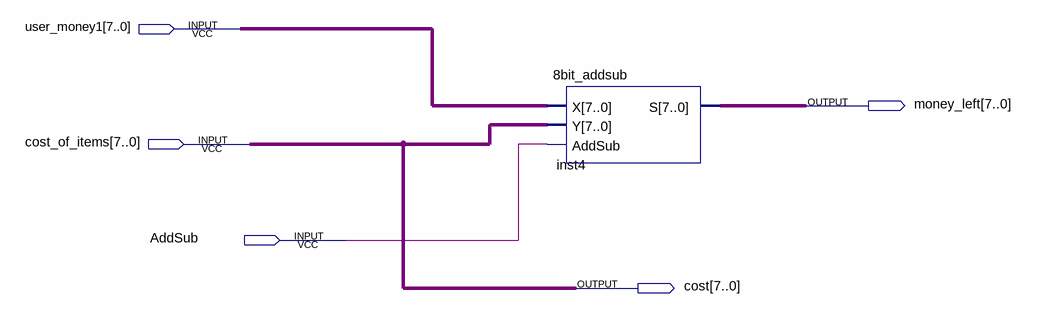
[diagram p0: schematic sheet]
// Quartus schematic confirm_menu.bdf as structural Verilog: 1 symbols, 5 pins
module confirm_menu (
  input  [7:0] user_money1,
  input  [7:0] cost_of_items,
  input  AddSub,
  output [7:0] money_left,
  output [7:0] cost
);

  \8bit_addsub  inst4 (.X(user_money1), .Y(cost_of_items), .AddSub(AddSub), .S(money_left));

  assign cost = cost_of_items;
endmodule
